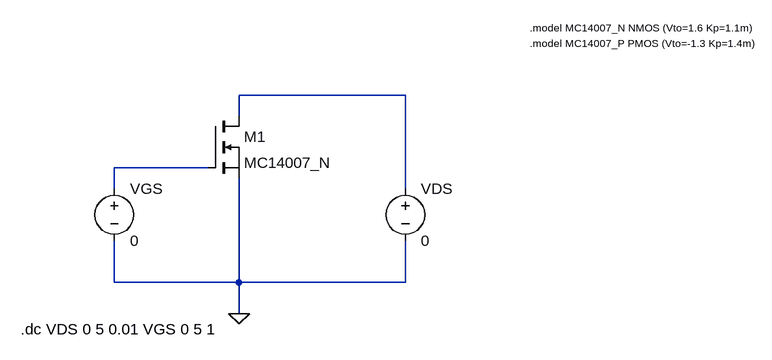
[diagram p0: schematic 1.1.1.asc]
1.1.1.asc, the LTspice schematic file:
Version 4
SHEET 1 880 680
WIRE -176 32 -432 32
WIRE -432 64 -432 32
WIRE -480 144 -624 144
WIRE -624 176 -624 144
WIRE -176 176 -176 32
WIRE -624 320 -624 256
WIRE -432 320 -432 160
WIRE -432 320 -624 320
WIRE -176 320 -176 256
WIRE -176 320 -432 320
WIRE -432 368 -432 320
FLAG -432 368 0
SYMBOL nmos -480 64 R0
SYMATTR InstName M1
SYMATTR Value MC14007_N
SYMBOL voltage -176 160 R0
SYMATTR InstName VDS
SYMATTR Value 0
SYMBOL voltage -624 160 R0
SYMATTR InstName VGS
SYMATTR Value 0
TEXT 16 -72 Left 1 !.model MC14007_N NMOS (Vto=1.6 Kp=1.1m)
TEXT 16 -48 Left 1 !.model MC14007_P PMOS (Vto=-1.3 Kp=1.4m)
TEXT -768 392 Left 2 !.dc VDS 0 5 0.01 VGS 0 5 1

The netlist it stands for:
* 1.1.1.asc
M1 N001 N002 0 0 MC14007_N
VDS N001 0 0
VGS N002 0 0
.model NMOS NMOS
.model PMOS PMOS
.lib standard.mos
.model MC14007_N NMOS (Vto=1.6 Kp=1.1m)
.model MC14007_P PMOS (Vto=-1.3 Kp=1.4m)
.dc VDS 0 5 0.01 VGS 0 5 1
.backanno
.end